# Altium schematic sheet LCD.SchDoc
size A
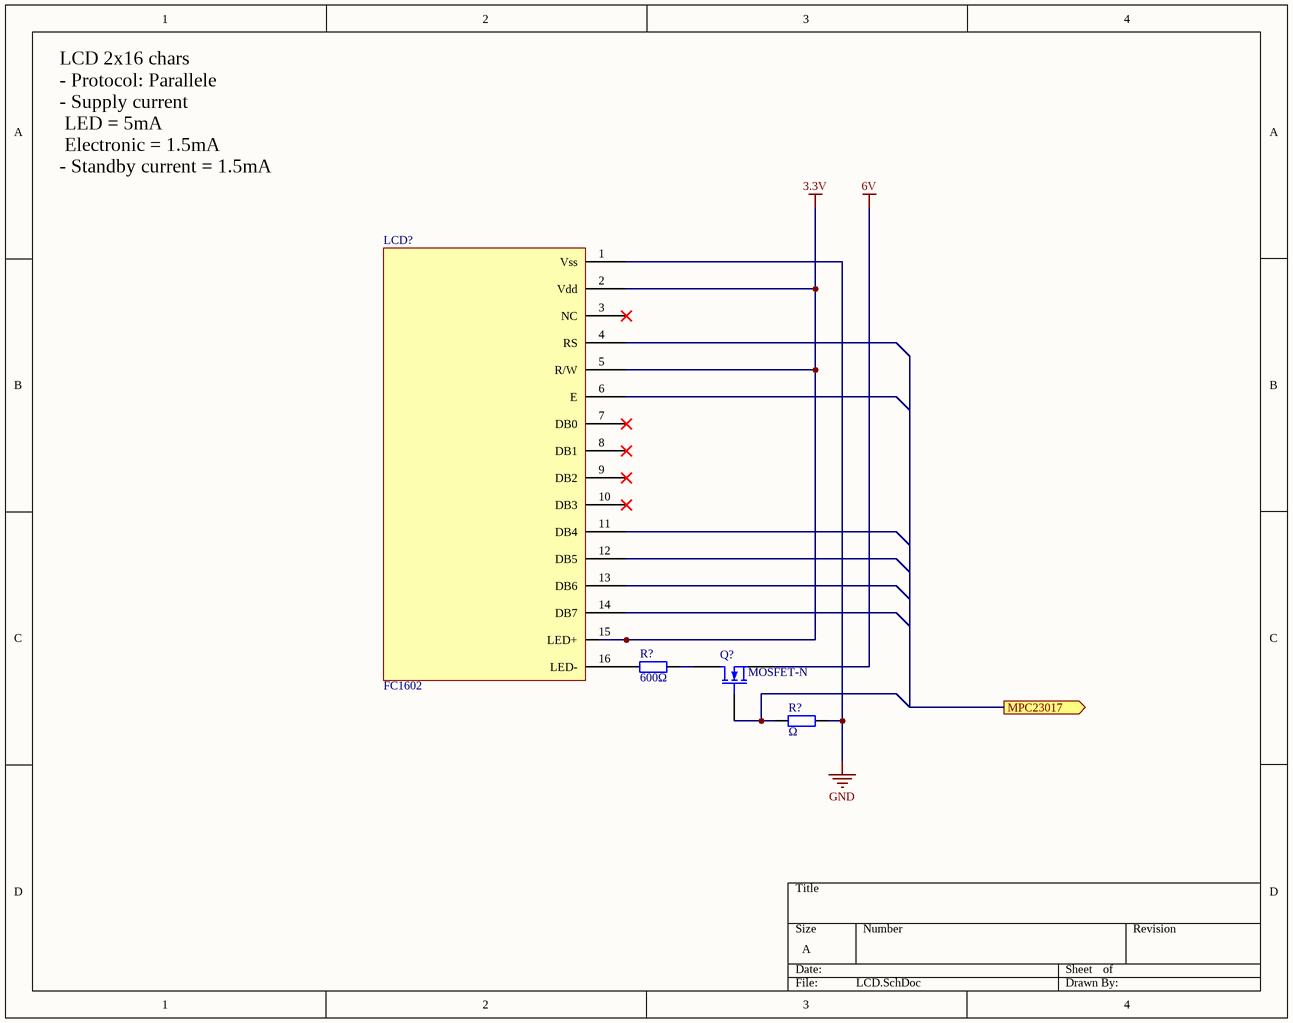
[diagram p0: LCD.SchDoc]

## Parts
(Parts that share a designator on the sheet are numbered #1, #2 ... from top to bottom, then left to right.)
LCD?  FC1602
Q?  MOSFET-N  [E3]
R?#1  600Ω  [AXIAL-0.4]
R?#2  Ω  [AXIAL-0.4]

## Ports
MPC23017 (out)

## Nets
3.3V: LCD?.2(Vdd) LCD?.5(R/W) LCD?.15(LED+)
6V: Q?.3(S)
GND: LCD?.1(Vss) R?#2.1
NetLCD?_16: LCD?.16(LED-) R?#1.2
NetQ?_1: Q?.1(D) R?#1.1
NetQ?_2: Q?.2(G) R?#2.2

Not connected (* = marked no-connect by the designer): LCD? 3(NC)* 4(RS) 6(E) 7(DB0)* 8(DB1)* 9(DB2)* 10(DB3)* 11(DB4) 12(DB5) 13(DB6) 14(DB7)

## Notes on the sheet
- LCD 2x16 chars
  - Protocol: Parallele
  - Supply current
  LED	= 5mA
  Electronic	= 1.5mA
  - Standby current = 1.5mA

## Library data of the parts
LCD? = Component_1
Q? = MOSFET-N: N-Channel MOSFET; Published: 8-Jun-2000; LatestRevisionDate: 17-Jul-2002; LatestRevisionNote: Re-released for DXP Platform.; PackageVersion: 1995/1996; PackageReference: E3; Publisher: Altium Limited; PackageDescription: TO, Flat Index; 3 In-Line, Axial Leads; Body Dia. 4.6mm; Lead Dia. 0.5 mm (max)
R?#1 R?#2 = Res2: Resistor; Value: 1K; Published: 8-Jun-2000; LatestRevisionDate: 17-Jul-2002; LatestRevisionNote: Re-released for DXP Platform.; PackageReference: AXIAL-0.4; Publisher: Altium Limited; PackageDescription: Axial Device, Thru-Hole; 2 Leads; 0.4 in Pin Spacing